# Altium schematic sheet Power.SchDoc
size 431 x 279 mm; DocumentNumber: 4; SheetNumber: 4; SheetTotal: 7
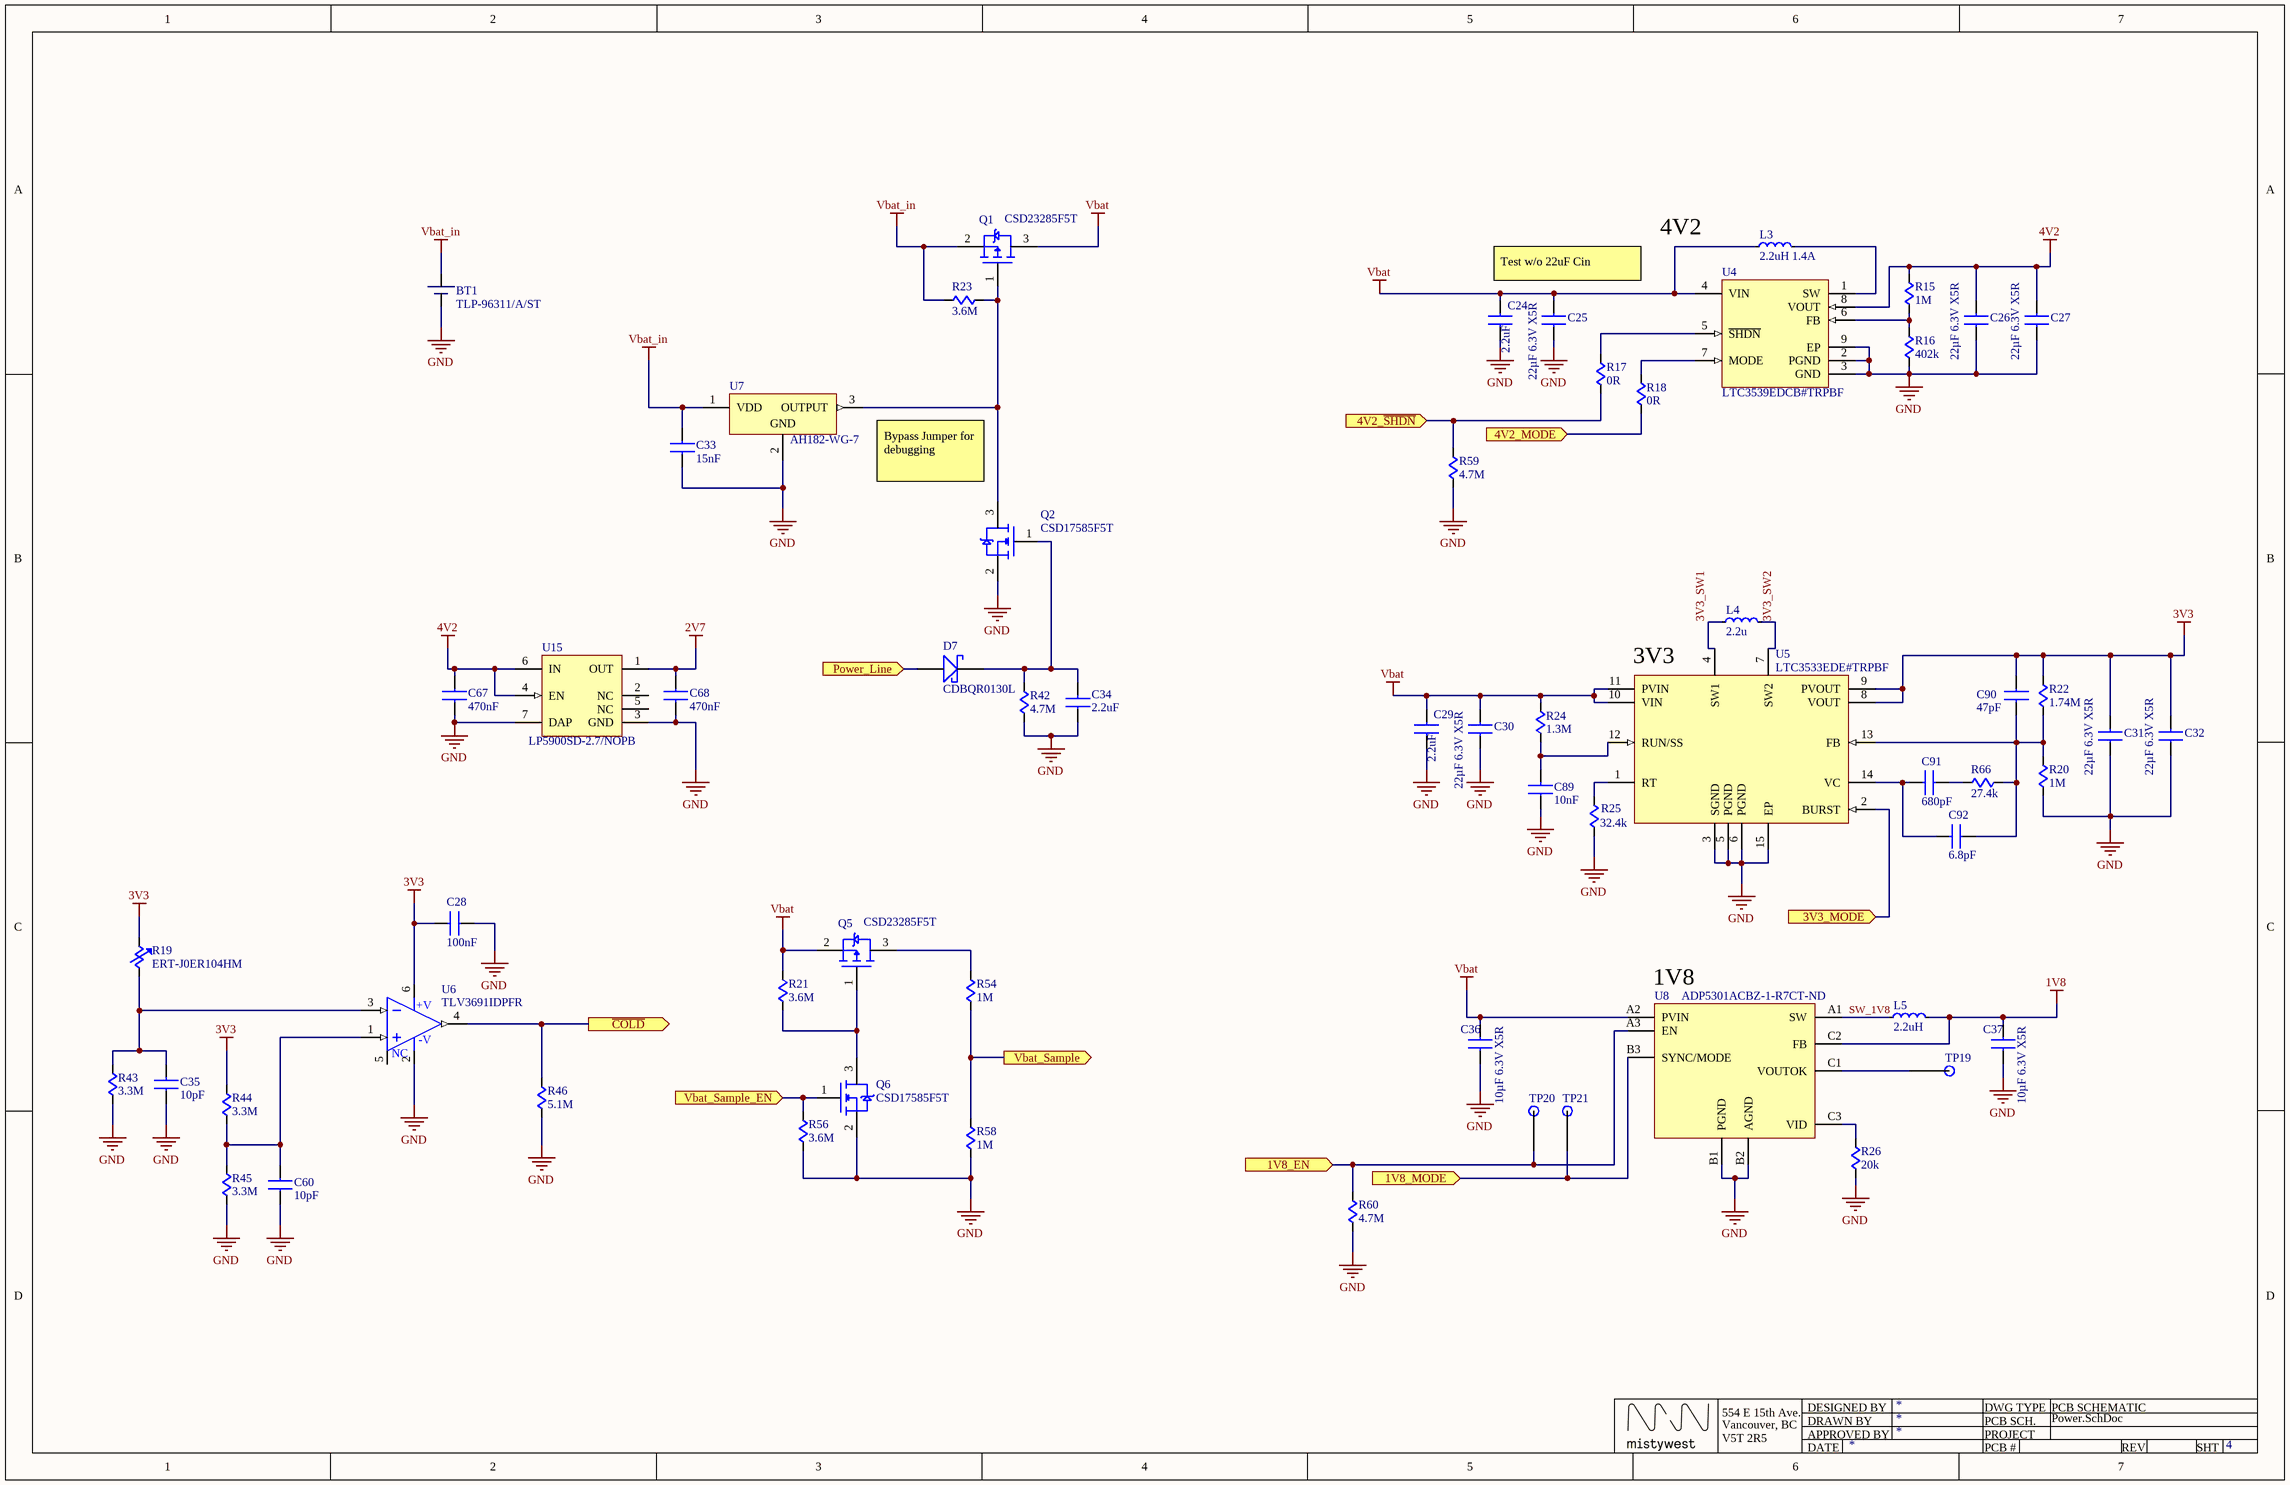
[diagram p0: Power.SchDoc]

## Parts
BT1  TLP-96311/A/ST  [TLP-96311/A/ST]
C24  2.2uF  [CAPC1608N-0603]
C25  22µF 6.3V X5R  [CAPC1608N-0603]
C26  22µF 6.3V X5R  [CAPC1608N-0603]
C27  22µF 6.3V X5R  [CAPC1608N-0603]
C28  100nF  [CAPC1005N-0402]
C29  2.2uF  [CAPC1608N-0603]
C30  22µF 6.3V X5R  [CAPC1608N-0603]
C31  22µF 6.3V X5R  [CAPC1608N-0603]
C32  22µF 6.3V X5R  [CAPC1608N-0603]
C33  15nF  [CAPC60X30X33L15N]
C34  2.2uF  [CAPC1608N-0603]
C35  10pF  [CAPC1005N-0402]
C36  10µF 6.3V X5R  [CAPC1608N-0603]
C37  10µF 6.3V X5R  [CAPC1608N-0603]
C60  10pF  [CAPC1005N-0402]
C67  470nF  [CAPC60X30X33L15N]
C68  470nF  [CAPC60X30X33L15N]
C89  10nF  [CAPC1005N-0402]
C90  47pF  [CAPC1005N-0402]
C91  680pF  [CAPC1005N-0402]
C92  6.8pF  [CAPC1005N-0402]
D7  CDBQR0130L  [CDBQR0130L]
L3  2.2uH 1.4A  [XFL3012]
L4  2.2u  [XAL4020]
L5  2.2uH  [XPL2010]
Q1  CSD23285F5T  [3-XFDFN]
Q2  CSD17585F5T  [3-XFDFN]
Q5  CSD23285F5T  [3-XFDFN]
Q6  CSD17585F5T  [3-XFDFN]
R15  1M  [RESC0402(1005)_N]
R16  402k  [RESC0402(1005)_N]
R17  0R  [Chip Res 1608_0603 MMC]
R18  0R  [Chip Res 1608_0603 MMC]
R19  ERT-J0ER104HM  [RESC0402(1005)_N]
R20  1M  [RESC0402(1005)_N]
R21  3.6M  [RESC0402(1005)_N]
R22  1.74M  [RESC0402(1005)_N]
R23  3.6M  [RESC0402(1005)_N]
R24  1.3M  [RESC0402(1005)_N]
R25  32.4k  [RESC0402(1005)_N]
R26  20k  [RESC0402(1005)_N]
R42  4.7M  [Chip Res 1608_0603 MMC]
R43  3.3M  [RESC0402(1005)_N]
R44  3.3M  [RESC0402(1005)_N]
R45  3.3M  [RESC0402(1005)_N]
R46  5.1M  [RESC0402(1005)_N]
R54  1M  [RESC0402(1005)_N]
R56  3.6M  [RESC0402(1005)_N]
R58  1M  [RESC0402(1005)_N]
R59  4.7M  [Chip Res 1608_0603 MMC]
R60  4.7M  [Chip Res 1608_0603 MMC]
R66  27.4k  [RESC0402(1005)_N]
TP19  (no value)  [Testpoint_16mil_32mil]  (no BOM)
TP20  (no value)  [Testpoint_16mil_32mil]  (no BOM)
TP21  (no value)  [Testpoint_16mil_32mil]  (no BOM)
U4  LTC3539EDCB#TRPBF  [LT-DCB-8_V]
U5  LTC3533EDE#TRPBF  [LT-DE-14_V]
U6  TLV3691IDPFR  [6-X2SON (1x1)]
U7  AH182-WG-7  [DIOD-SC59-3_L]
U8  ADP5301ACBZ-1-R7CT-ND  [9-Ball WLCSP]
U15  LP5900SD-2.7/NOPB  [NGF0006A_V]

## Ports
1V8_EN (in), 1V8_MODE (in), 3V3_MODE (in), 4V2_MODE (in), 4V2_~{SHDN} (in), Power_Line (in), Vbat_Sample (out), Vbat_Sample_EN (in), ~{COLD} (out)

## Nets
1V8: C37.1 L5.2 U8.C2(FB)
2V7: C68.1 U15.1(OUT)
3V3: C28.1 C31.1 C32.1 C90.1 R19.1 R22.2 R44.2 U5.8(VOUT) U5.9(PVOUT) U6.6(V+)
4V2: C26.1 C27.1 C67.1 R15.2 U4.8(VOUT) U15.4(EN) U15.6(IN)
GND: BT1.2 C24.2 C25.2 C26.2 C27.2 C28.2 C29.2 C30.2 C31.2 C32.2 C33.2 C34.2 C35.2 C36.2 C37.2 C60.2 C67.2 C68.2 C89.2 Q2.2(Source) Q6.2(Source) R16.1 R20.1 R25.1 R26.1 R42.1 R43.1 R45.1 R46.1 R56.2 R58.1 R59.1 R60.1 U4.2(PGND) U4.3(GND) U4.9(EP) U5.3(SGND) U5.5(PGND) U5.6(PGND) U5.15(EP) U6.2(V-) U7.2(GND) U8.B1(PGND) U8.B2(AGND) U15.3(GND) U15.7(DAP)
Vbat: C24.1 C25.1 C29.1 C30.1 C36.1 L3.1 Q1.3(Drain) Q5.2(Source) R21.1 R24.2 U4.4(VIN) U5.10(VIN) U5.11(PVIN) U8.A2(PVIN)
Vbat_in: BT1.1 C33.1 Q1.2(Source) R23.2 U7.1(VDD)
1V8_EN: R60.2 TP20.TP U8.A3(EN) ; port 1V8_EN
1V8_MODE: TP21.TP U8.B3(SYNC/MODE) ; port 1V8_MODE
3V3_MODE: U5.2(BURST) ; port 3V3_MODE
3V3_SW1: L4.1 U5.4(SW1)
3V3_SW2: L4.2 U5.7(SW2)
4V2_MODE: R18.1 ; port 4V2_MODE
4V2_~{SHDN}: R17.1 R59.2 ; port 4V2_~{SHDN}
~{COLD}: R46.2 U6.4(OUT_A) ; port ~{COLD}
Power_Line: D7.1(Anode) ; port Power_Line
SW_1V8: L5.1 U8.A1(SW)
Vbat_Sample: R54.1 R58.2 ; port Vbat_Sample
Vbat_Sample_EN: Q6.1(Gate) R56.1 ; port Vbat_Sample_EN
NetC34_1: C34.1 D7.2(Cathode) Q2.1(Gate) R42.2
NetC35_1: C35.1 R19.2 R43.2 U6.3(-IN_A)
NetC60_1: C60.1 R44.1 R45.2 U6.1(+IN_A)
NetC89_1: C89.1 R24.1 U5.12(RUN/SS)
NetC90_2: C90.2 C92.2 R20.2 R22.1 R66.1 U5.13(FB)
NetC91_1: C91.1 C92.1 U5.14(VC)
NetC91_2: C91.2 R66.2
NetL3_2: L3.2 U4.1(SW)
NetQ1_1: Q1.1(Gate) Q2.3(Drain) R23.1 U7.3(OUTPUT)
NetQ5_1: Q5.1(Gate) Q6.3(Drain) R21.2
NetQ5_3: Q5.3(Drain) R54.2
NetR15_1: R15.1 R16.2 U4.6(FB)
NetR17_2: R17.2 U4.5(~{SHDN})
NetR18_2: R18.2 U4.7(MODE)
NetR25_2: R25.2 U5.1(RT)
NetR26_2: R26.2 U8.C3(VID)
NetTP19_TP: TP19.TP U8.C1(VOUTOK)

Not connected (* = marked no-connect by the designer): U6 5(V-); U15 2(NC) 5(NC)

## Notes on the sheet
- 4V2
- Test w/o 22uF Cin
- Bypass Jumper for debugging
- (near U5) 3V3
- (near U8) 1V8
- 554 E 15th Ave.
- Vancouver, BC
- PCB SCHEMATIC
- V5T 2R5
- DESIGNED BY
  DRAWN BY
  APPROVED BY
  DATE
- DWG TYPE
  PCB SCH.
  PROJECT
  PCB #
- REV  =Revision
- SHT  =SheetNumber OF =SheetTotal
- (in symbol CMP-004-0002-2) +V; -V; NC

## Library data of the parts
BT1 = CMP-04553-1: Manufacturer: Tadiran; Manufacturer Part Number: TLP-96311/A/ST
C24 C29 C34 = CMP-00020-6: CAP CER 2.2uF 6.3V X7R 0603 ±10%; Manufacturer: Samsung Electro-Mechanics America, Inc.; Manufacturer Part Number: CL10B225KQ8NNNC; RevisionId: 4; AccessRights: 2147483647; Folder: MW_Parts\Components\Capacitors\Ceramic\Ceramic Filters\0603\X7R\; ContentType: Component; Capacitance: 2.2µF; AncestorItemRevisionGUID: FD4A8CC3-31FA-4A66-9712-160D8DBE6555; LifeCycleStateGUID: 706004B5-C76E-482E-903B-BA0E4FAE086A; ReleaseDate: 10/08/2017 12:10:01 AM; ContentTypeGUID: CB3C11C4-E317-11DF-B822-12313F0024A2; ItemGUID: 925A68DB-E8AB-4695-A8C2-CD495729C191; ItemHRID: CMP-00020; FolderGUID: A577C078-63D7-4DB2-AF73-306BC16B6D3B; LifeCycle: Draft; ComponentType: Capacitor; Temperature Coefficient: X7R; Voltage: 6.3V; Tolerance: ±10%
C25-C27 C30-C32 = CMP-03705-2: CAP CER 22UF 6.3V X5R 0603 ±10%; Manufacturer: Samsung Electro-Mechanics America, Inc.; Manufacturer Part Number: CL10A226KQ8NRNE; Capacitance: 22µF; Temperature Coefficient: X5R; Tolerance: ±10%; Voltage: 6.3V
C28 = CMP-02680-4: CAP CER 0.1UF 10V X7R 0402 ±5%; Manufacturer: Samsung Electro-Mechanics America, Inc.; Manufacturer Part Number: CL05B104JP5NNNC; RevisionId: 2; AccessRights: 2147483647; Folder: MW_Parts\Components\Capacitors\Ceramic\Ceramic Filters\0402\X7R\; ContentType: Component; AncestorItemRevisionGUID: B5B9AEA9-2888-4609-98C5-D2A143A2E055; LifeCycleStateGUID: 706004B5-C76E-482E-903B-BA0E4FAE086A; ReleaseDate: 21/08/2017 11:02:50 PM; ContentTypeGUID: CB3C11C4-E317-11DF-B822-12313F0024A2; ItemGUID: 98D0CBC0-CD69-4B1B-A7E9-949A7B6C034B; ItemHRID: CMP-02680; FolderGUID: EC3CA227-945F-4B62-A70C-0C1E94DF012A; LifeCycle: Draft; ComponentType: Capacitor; Capacitance: 100nF; Temperature Coefficient: X7R; Tolerance: ±5%; Voltage: 10V
C33 = CMP-02936-1: CAP CER 15nF 6.3V X5R 0201 ±10%; Manufacturer: Samsung Electro-Mechanics America, Inc.; Manufacturer Part Number: CL03A153KQ3NNNC; Capacitance: 15nF; Temperature Coefficient: X5R; Tolerance: ±10%; Voltage: 6.3V
C35 C60 = CMP-02777-2: CAP CER 10PF 50V C0G/NP0 0402 ±0.5pF; Manufacturer: Samsung Electro-Mechanics America, Inc.; Manufacturer Part Number: CL05C100DB5NNNC; Temperature Coefficient: C0G, NP0; Capacitance: 10pF; Tolerance: ±0.5pF; Voltage: 50V
C36 C37 = CMP-03702-2: CAP CER 10UF 6.3V X5R 0603 ±10%; Manufacturer: Samsung Electro-Mechanics America, Inc.; Manufacturer Part Number: CL10A106KQ8NNNC; Capacitance: 10µF; Temperature Coefficient: X5R; Tolerance: ±10%; Voltage: 6.3V
C67 C68 = CMP-02944-1: CAP CER 470nF 6.3V X5R 0201 ±10%; Manufacturer: Samsung Electro-Mechanics America, Inc.; Manufacturer Part Number: CL03A474KQ3NNNC; Capacitance: 470nF; Temperature Coefficient: X5R; Tolerance: ±10%; Voltage: 6.3V
C89 = CMP-02688-4: CAP CER 10000PF 10V X7R 0402 ±10%; Manufacturer: Samsung Electro-Mechanics America, Inc.; Manufacturer Part Number: CL05B103KP5NNNC; RevisionId: 2; AccessRights: 2147483647; Folder: MW_Parts\Components\Capacitors\Ceramic\Ceramic Filters\0402\X7R\; ContentType: Component; AncestorItemRevisionGUID: FBEF5854-9E39-482B-85E2-851CE328D631; LifeCycleStateGUID: 706004B5-C76E-482E-903B-BA0E4FAE086A; ReleaseDate: 21/08/2017 11:02:51 PM; ContentTypeGUID: CB3C11C4-E317-11DF-B822-12313F0024A2; ItemGUID: 32F95929-C4EE-43CA-91BC-E7F6B815331F; ItemHRID: CMP-02688; FolderGUID: EC3CA227-945F-4B62-A70C-0C1E94DF012A; LifeCycle: Draft; ComponentType: Capacitor; Capacitance: 10nF; Temperature Coefficient: X7R; Tolerance: ±10%; Voltage: 10V
C90 = CMP-02901-2: CAP CER 47PF 50V C0G/NP0 0402 ±5% AEC-Q200; Manufacturer: Samsung Electro-Mechanics America, Inc.; Manufacturer Part Number: CL05C470JB51PNC; Temperature Coefficient: C0G, NP0; Capacitance: 47pF; Tolerance: ±5%; Voltage: 50V
C91 = CMP-02855-2: CAP CER 680PF 50V C0G/NP0 0402 ±5%; Manufacturer: Samsung Electro-Mechanics America, Inc.; Manufacturer Part Number: CL05C681JB5NNNC; Temperature Coefficient: C0G, NP0; Capacitance: 680pF; Tolerance: ±5%; Voltage: 50V
C92 = CMP-02852-2: CAP CER 6.8PF 50V C0G/NP0 0402 ±0.25pF; Manufacturer: Samsung Electro-Mechanics America, Inc.; Manufacturer Part Number: CL05C6R8CB5NNNC; Temperature Coefficient: C0G, NP0; Capacitance: 6.8pF; Tolerance: ±0.25pF; Voltage: 50V
D7 = CMP-04108-1: Diode Schottky 30V 100mA Surface Mount 0402/SOD-923F; Manufacturer: Comchip Technology; Voltage - Forward (Vf): 350mV; Current - Average Rectified: 100mA; Manufacturer Part Number: CDBQR0130L; Voltage - DC Reverse: 30V
L3 = CMP-04184-2: XFL3012-222ME_; Manufacturer: CoilCraft; DC Resistance: 0.081; Inductance: 2.2µH; Current Rating: 1.4A; Manufacturer Part Number: XFL3012-222ME_
L4 = CMP-ROOT-0005-7: XAL4020-222ME; Manufacturer: CoilCraft; Current Rating: 4A; DC Resistance: 0.0352; Inductance: 2.2µH; Manufacturer Part Number: XAL4020-222ME
L5 = CMP-01885-1: XPL2010-222ML; Manufacturer: CoilCraft; Current Rating: 1.2A; DC Resistance: 1.56d; Inductance: 2.2µH; Manufacturer Part Number: XPL2010-222ML
Q1 Q5 = CMP-04199-1: P-Channel 12V 5.4A (Ta) 500mW (Ta) Surface Mount 3-PICOSTAR; Manufacturer: Texas Instruments; Ciss: 628pF @ 6V; Id (25C): 4.5A; Rds On: 34mOhm; Manufacturer Part Number: CSD23285F5T; Power - Max: 500mW (Ta); Vdss: 12V
Q2 Q6 = CMP-04200-1: N-Channel 30V 5.9A (Ta) 500mW (Ta) Surface Mount 3-PICOSTAR; Manufacturer: Texas Instruments; Ciss: 380pF @ 15V; Id (25C): 27 mOhm; Rds On: 27mOhm; Manufacturer Part Number: CSD17585F5T; Power - Max: 500mW (Ta); Vdss: 30V
R15 R20 = CMP-02533-2: RES SMD 1M OHM 1% 1/16W 0402; Manufacturer: Yageo; Manufacturer Part Number: RC0402FR-071ML; RevisionId: 1; AccessRights: 2147483647; Folder: MW_Parts\Components\Resistors\0402\; ContentType: Component; Power: 0.063W, 1/16W; LifeCycleStateGUID: 706004B5-C76E-482E-903B-BA0E4FAE086A; ReleaseDate: 14/08/2017 09:06:44 PM; ContentTypeGUID: CB3C11C4-E317-11DF-B822-12313F0024A2; ItemGUID: 38EDC7A2-DA10-4150-BC5B-F9F8654795AC; ItemHRID: CMP-02533; FolderGUID: FF00D775-EA76-40F5-8F49-C5946BC46B28; LifeCycle: Draft; ComponentType: Resistor; Resistance: 1M; Tolerance: ±1%
R16 = CMP-02318-2: RES SMD 402K OHM 1% 1/10W 0402; Manufacturer: Panasonic Electronic Components; Manufacturer Part Number: ERJ-2RKF4023X; RevisionId: 1; AccessRights: 2147483647; Folder: MW_Parts\Components\Resistors\0402\; ContentType: Component; Power: 0.1W, 1/10W; LifeCycleStateGUID: 706004B5-C76E-482E-903B-BA0E4FAE086A; ReleaseDate: 14/08/2017 09:07:59 PM; ContentTypeGUID: CB3C11C4-E317-11DF-B822-12313F0024A2; ItemGUID: F255A748-FBF8-468D-925E-B2091673D62C; ItemHRID: CMP-02318; FolderGUID: FF00D775-EA76-40F5-8F49-C5946BC46B28; LifeCycle: Draft; ComponentType: Resistor; Resistance: 402k; Tolerance: ±1%
R17 R18 = CMP-00849-1: 0R 0.1W; Manufacturer: Yageo; Manufacturer Part Number: RC0603JR-070RL; Power: 0.1W; Resistance: 0R
R19 = CMP-04254-1: NTC Thermistor 100k 0402 (1005 Metric); Manufacturer: Panasonic Electronic Components; Power: 66mW; Tolerance: ±3%; Manufacturer Part Number: ERT-J0ER104HM; Resistance: 100k
R21 R23 R56 = CMP-02536-2: RES SMD 3.6M OHM 1% 1/16W 0402; Manufacturer: Yageo; Manufacturer Part Number: RC0402FR-073M6L; RevisionId: 1; AccessRights: 2147483647; Folder: MW_Parts\Components\Resistors\0402\; ContentType: Component; Power: 0.063W, 1/16W; LifeCycleStateGUID: 706004B5-C76E-482E-903B-BA0E4FAE086A; ReleaseDate: 14/08/2017 09:06:44 PM; ContentTypeGUID: CB3C11C4-E317-11DF-B822-12313F0024A2; ItemGUID: 8734D7F0-F7B6-4093-81FA-6769CE3BA6FB; ItemHRID: CMP-02536; FolderGUID: FF00D775-EA76-40F5-8F49-C5946BC46B28; LifeCycle: Draft; ComponentType: Resistor; Resistance: 3.6M; Tolerance: ±1%
R22 = CMP-02623-2: RES SMD 1.74M OHM 1% 1/16W 0402; Manufacturer: Yageo; Manufacturer Part Number: RC0402FR-071M74L; RevisionId: 1; AccessRights: 2147483647; Folder: MW_Parts\Components\Resistors\0402\; ContentType: Component; Power: 0.063W, 1/16W; LifeCycleStateGUID: 706004B5-C76E-482E-903B-BA0E4FAE086A; ReleaseDate: 14/08/2017 09:07:23 PM; ContentTypeGUID: CB3C11C4-E317-11DF-B822-12313F0024A2; ItemGUID: A7717856-515F-430C-BA48-75DCCEC390A2; ItemHRID: CMP-02623; FolderGUID: FF00D775-EA76-40F5-8F49-C5946BC46B28; LifeCycle: Draft; ComponentType: Resistor; Resistance: 1.74M; Tolerance: ±1%
R24 = CMP-02634-2: RES SMD 1.3M OHM 1% 1/16W 0402; Manufacturer: Yageo; Manufacturer Part Number: RC0402FR-071M3L; RevisionId: 1; AccessRights: 2147483647; Folder: MW_Parts\Components\Resistors\0402\; ContentType: Component; Power: 0.063W, 1/16W; LifeCycleStateGUID: 706004B5-C76E-482E-903B-BA0E4FAE086A; ReleaseDate: 14/08/2017 09:07:26 PM; ContentTypeGUID: CB3C11C4-E317-11DF-B822-12313F0024A2; ItemGUID: 9B0B9386-4B31-4CD2-8CC3-C820CA8E7942; ItemHRID: CMP-02634; FolderGUID: FF00D775-EA76-40F5-8F49-C5946BC46B28; LifeCycle: Draft; ComponentType: Resistor; Resistance: 1.3M; Tolerance: ±1%
R25 = CMP-02256-2: RES SMD 32.4K OHM 1% 1/10W 0402; Manufacturer: Panasonic Electronic Components; Manufacturer Part Number: ERJ-2RKF3242X; RevisionId: 1; AccessRights: 2147483647; Folder: MW_Parts\Components\Resistors\0402\; ContentType: Component; Power: 0.1W, 1/10W; LifeCycleStateGUID: 706004B5-C76E-482E-903B-BA0E4FAE086A; ReleaseDate: 14/08/2017 09:07:33 PM; ContentTypeGUID: CB3C11C4-E317-11DF-B822-12313F0024A2; ItemGUID: 1331F2ED-5F25-44A8-BD1D-115D098793A9; ItemHRID: CMP-02256; FolderGUID: FF00D775-EA76-40F5-8F49-C5946BC46B28; LifeCycle: Draft; ComponentType: Resistor; Resistance: 32.4k; Tolerance: ±1%
R26 = CMP-02144-2: RES SMD 20K OHM 1% 1/10W 0402; Manufacturer: Panasonic Electronic Components; Manufacturer Part Number: ERJ-2RKF2002X; RevisionId: 1; AccessRights: 2147483647; Folder: MW_Parts\Components\Resistors\0402\; ContentType: Component; Power: 0.1W, 1/10W; LifeCycleStateGUID: 706004B5-C76E-482E-903B-BA0E4FAE086A; ReleaseDate: 14/08/2017 09:06:48 PM; ContentTypeGUID: CB3C11C4-E317-11DF-B822-12313F0024A2; ItemGUID: 245E70CF-89B0-4834-9BD7-29B1B6060D32; ItemHRID: CMP-02144; FolderGUID: FF00D775-EA76-40F5-8F49-C5946BC46B28; LifeCycle: Draft; ComponentType: Resistor; Resistance: 20k; Tolerance: ±1%
R42 R59 R60 = CMP-01396-1: RES SMD 4.7M ±1% 0.1W, 1/10W 0603; Manufacturer: Yageo; Manufacturer Part Number: RC0603FR-074M7L; Power: 0.1W, 1/10W; Resistance: 4.7M; Tolerance: ±1%
R43-R45 = CMP-02534-2: RES SMD 3.3M OHM 1% 1/16W 0402; Manufacturer: Yageo; Manufacturer Part Number: RC0402FR-073M3L; RevisionId: 1; AccessRights: 2147483647; Folder: MW_Parts\Components\Resistors\0402\; ContentType: Component; Power: 0.063W, 1/16W; LifeCycleStateGUID: 706004B5-C76E-482E-903B-BA0E4FAE086A; ReleaseDate: 14/08/2017 09:06:44 PM; ContentTypeGUID: CB3C11C4-E317-11DF-B822-12313F0024A2; ItemGUID: 2750FAA4-7402-4D1C-AED3-E6D1F33D113D; ItemHRID: CMP-02534; FolderGUID: FF00D775-EA76-40F5-8F49-C5946BC46B28; LifeCycle: Draft; ComponentType: Resistor; Resistance: 3.3M; Tolerance: ±1%
R46 = CMP-02569-2: RES SMD 5.1M OHM 1% 1/16W 0402; Manufacturer: Yageo; Manufacturer Part Number: RC0402FR-075M1L; RevisionId: 1; AccessRights: 2147483647; Folder: MW_Parts\Components\Resistors\0402\; ContentType: Component; Power: 0.063W, 1/16W; LifeCycleStateGUID: 706004B5-C76E-482E-903B-BA0E4FAE086A; ReleaseDate: 14/08/2017 09:07:06 PM; ContentTypeGUID: CB3C11C4-E317-11DF-B822-12313F0024A2; ItemGUID: 2609F183-B3C3-48C1-9C12-A9D8EC9D3679; ItemHRID: CMP-02569; FolderGUID: FF00D775-EA76-40F5-8F49-C5946BC46B28; LifeCycle: Draft; ComponentType: Resistor; Resistance: 5.1M; Tolerance: ±1%
R54 = CMP-00047-2: RES SMD 1M OHM 1% 1/10W 0402; Manufacturer: Panasonic Electronic Components; Manufacturer Part Number: ERJ-2RKF1004X; RevisionId: 1; AccessRights: 2147483647; Folder: MW_Parts\Components\Resistors\0402\; ContentType: Component; Power: 0.1W, 1/10W; LifeCycleStateGUID: 706004B5-C76E-482E-903B-BA0E4FAE086A; ReleaseDate: 14/08/2017 09:07:29 PM; ContentTypeGUID: CB3C11C4-E317-11DF-B822-12313F0024A2; ItemGUID: F016CD9C-1E2D-405B-B396-FDCECECA31E2; ItemHRID: CMP-00047; FolderGUID: FF00D775-EA76-40F5-8F49-C5946BC46B28; LifeCycle: Draft; ComponentType: Resistor; Resistance: 1M; Tolerance: ±1%
R58 = CMP-00047-2: RES SMD 1M OHM 1% 1/10W 0402; Manufacturer: Panasonic Electronic Components; Manufacturer Part Number: ERJ-2RKF1004X; Power: 0.1W, 1/10W; RevisionId: 1; AccessRights: 2147483647; Folder: MW_Parts\Components\Resistors\0402\; ContentType: Component; Resistance: 1M; Tolerance: ±1%; LifeCycleStateGUID: 706004B5-C76E-482E-903B-BA0E4FAE086A; ReleaseDate: 14/08/2017 09:07:29 PM; ContentTypeGUID: CB3C11C4-E317-11DF-B822-12313F0024A2; ItemGUID: F016CD9C-1E2D-405B-B396-FDCECECA31E2; ItemHRID: CMP-00047; FolderGUID: FF00D775-EA76-40F5-8F49-C5946BC46B28; LifeCycle: Draft; ComponentType: Resistor
R66 = CMP-03766-1: RES SMD 27.4KOHM 0.1% 1/16W 0402 ±10ppm/°C; Manufacturer: TE Connectivity Passive Product; Manufacturer Part Number: RN73C1E27K4BTD; Power: 0.063W, 1/16W; Resistance: 27.4k; Tolerance: ±0.1%; Temp. Coefficent: ±10ppm/°C
TP19-TP21 = CMP-ROOT-0023-4: Test Point - 16mil/32mil via; RevisionId: 3; AccessRights: 2147483647; Folder: MW_Parts\Components\PCB Artwork (Logos, Fiducials, Easter Eggs, Etc.)\Test Points\; ContentType: Component; AncestorItemRevisionGUID: 75AF5AD0-AC2E-461C-A712-52160B1E82C4; LifeCycleStateGUID: 706004B5-C76E-482E-903B-BA0E4FAE086A; ReleaseDate: 23/08/2017 03:25:20 AM; ContentTypeGUID: CB3C11C4-E317-11DF-B822-12313F0024A2; ItemGUID: 542E3FDF-05CE-4787-ACB6-AECCF613BD0E; ItemHRID: CMP-ROOT-0023; FolderGUID: 826AF0AF-D3B5-4CC2-AA9D-34285EE49F0B; LifeCycle: Draft
U4 = CMP-04107-6: 2 A, 1 MHz / 2 MHz Synchronous Step-Up DC/DC Converter, 8-pin SON (DCB-8), -40 to 85 degC, Pb-Free, Tape and Reel; Manufacturer: Linear Technology; DatasheetVersion: Rev. B; PackageDescription: 8-Pin Plastic DFN, Body 2 x 3 mm, Pitch 0.45 mm; Manufacturer Part Number: LTC3539EDCB#TRPBF
U5 = CMP-01768-6: 2 A Wide Input Voltage Synchronous Buck-Boost DC/DC Converter, 14-pin SON (DE-14), -40 to 85 degC, Pb-Free, Tape and Reel; Manufacturer: Linear Technology; Manufacturer Part Number: LTC3533EDE#TRPBF
U6 = CMP-004-0002-2: Comparator General Purpose Push-Pull 6-X2SON (1x1); Manufacturer: Texas Instruments; Manufacturer Part Number: TLV3691IDPFR
U7 = CMP-04111-3: Low Power Hall Effect Switch, 2.5 to 5.5 V, -40 to 85 degC, 3-Pin SC59, RoHS, Tape and Reel; Manufacturer: Diodes Incorporated; Category: Sensors,Transducers; Manufacturer Part Number: AH182-WG-7
U8 = CMP-04109-2: Buck Switching Regulator IC Positive Programmable 0.8V 1 Output 50mA, 500mA 9-WFBGA, WLCSP; Manufacturer: ADP5301ACBZ-1-R7; Manufacturer Part Number: ADP5301ACBZ-1-R7
U15 = CMP-04731-1: Ultra Low Noise, 150mA Linear Regulator for RF/Analog Circuits Requires No Bypass Capacitor, 6-pin LLP, Pb-Free; Manufacturer: Texas Instruments; Dropout Voltage: 80mV; Output Voltage: 2.7V; Number of Outputs: 1; Min Input Voltage: 2.5V; Max Input Voltage: 5.5V; Polarity: Positive; Quiescent Current: 50uA; Output Voltage Accuracy: 2%; Output Type: Fixed; Manufacturer Part Number: LP5900SD-2.7/NOPB; Mount: Surface Mount; Number of Pins: 6; Min Operating Temperature: -40°C; Max Operating Temperature: 125°C; Packaging: Tape and Reel; Max Output Current: 150mA; Package Quantity: 1000; Output Current: 150mA; Number of Regulators: 1; Accuracy: 2%; Radiation Hardening: No; Lead Free: Lead Free